# Altium schematic sheet m2_connector.SchDoc
size A4; DocumentNumber: 4; SheetNumber: 4; SheetTotal: 9
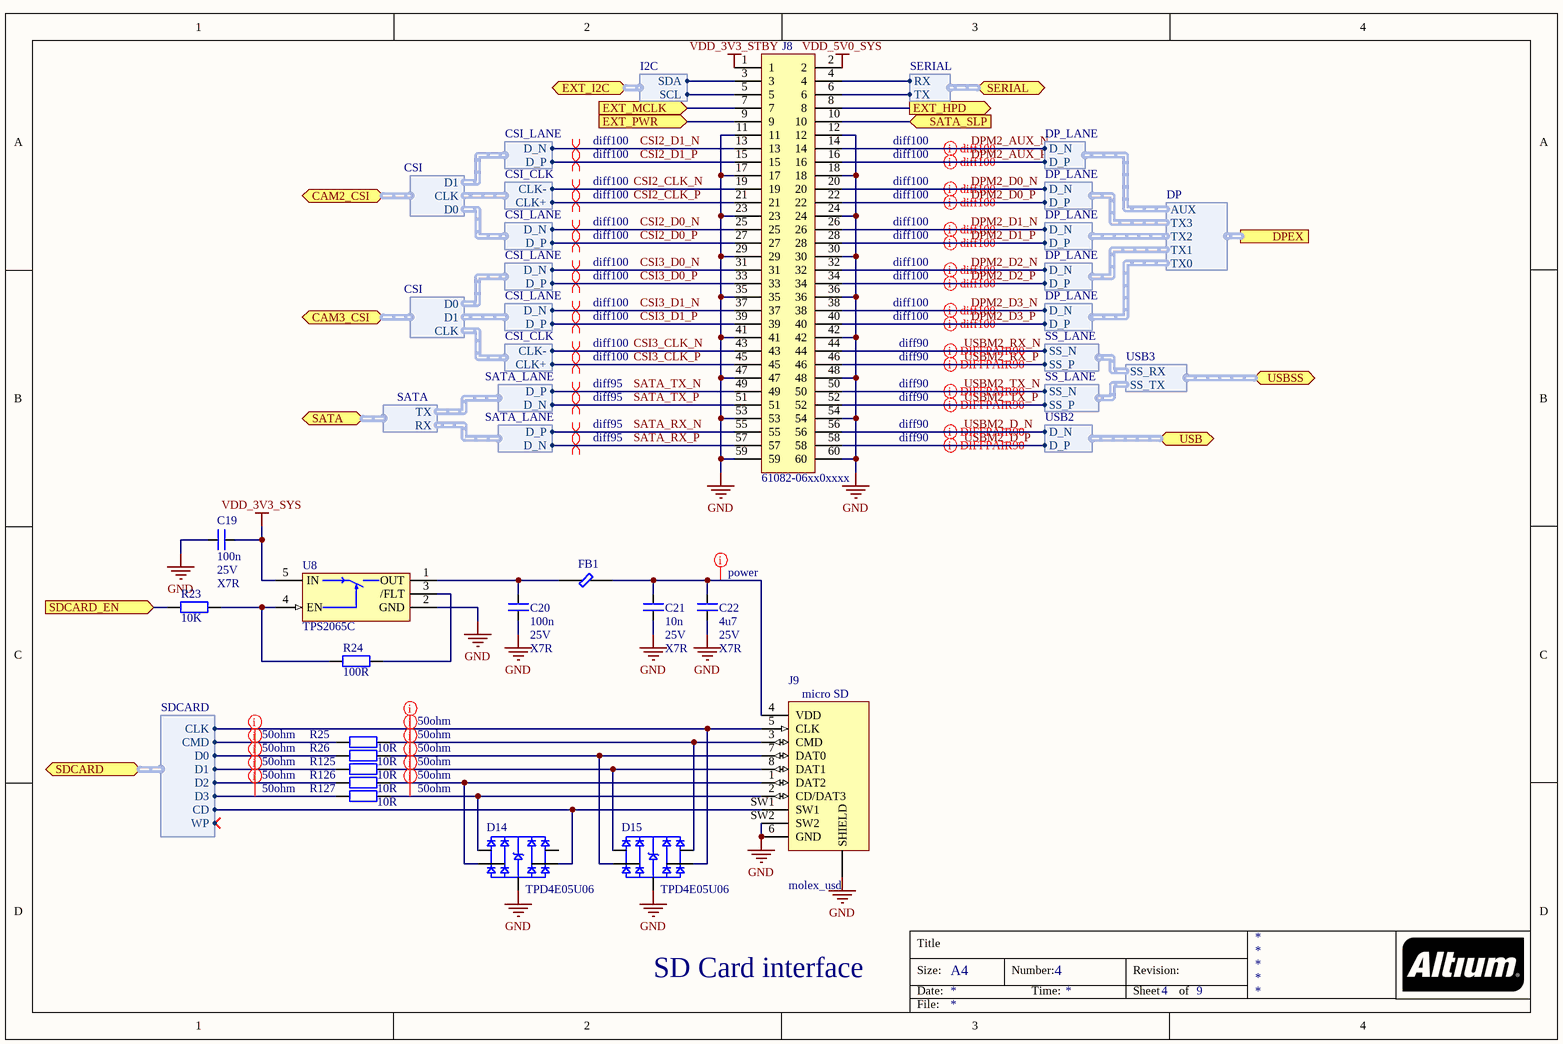
[diagram p0: m2_connector.SchDoc]

## Parts
C19  value 100n  Voltage: 25V  Type: X7R  [C1005[0402]]  (hidden comment: cap)
C20  value 100n  Voltage: 25V  Type: X7R  [C1005[0402]]  (hidden comment: cap)
C21  value 10n  Voltage: 25V  Type: X7R  [C1005[0402]]  (hidden comment: cap)
C22  value 4u7  Voltage: 25V  Type: X7R  [C3216[1206]]  (hidden comment: cap)
D14  TPD4E05U06  [TI_PSON50P100X55-10N]
D15  TPD4E05U06  [TI_PSON50P100X55-10N]
FB1  2506036007Y3  [FBC1608X07N]  (value not drawn)
J8  61082-06xx0xxxx  [fci_mezzanine_61082]
J9  molex_usd  [molex_usd]
R23  value 10K  [R1005[0402]]  (hidden comment: res)
R24  value 100R  [R1005[0402]]  (hidden comment: res)
R25  value 10R  [R1005[0402]]  (hidden comment: res)
R26  value 10R  [R1005[0402]]  (hidden comment: res)
R125  value 10R  [R1005[0402]]  (hidden comment: res)
R126  value 10R  [R1005[0402]]  (hidden comment: res)
R127  value 10R  [R1005[0402]]  (hidden comment: res)
U8  TPS2065C  [TI_SOT95P280X145-5N]

## Ports
CAM2_CSI (harness CSI), CAM3_CSI (harness CSI), DPEX (harness DP), EXT_HPD (out), EXT_I2C (harness I2C), EXT_MCLK (in), EXT_PWR (in), SATA (harness SATA), SATA_SLP (in), SDCARD (harness SDCARD), SDCARD_EN (in), SERIAL (harness SERIAL), USB (harness USB2), USBSS (harness USB3)

## Harnesses
SDCARD: CLK, CMD, WP, CD, D0, D1, D2, D3
SS_LANE: SS_P, SS_N
USB3: SS_RX, SS_TX
DP_LANE: D_N, D_P
DP: TX0, TX1, TX2, TX3, AUX
CSI_LANE: D_P, D_N
CSI_CLK: CLK-, CLK+
CSI: CLK, D0, D1
I2C: SDA, SCL
SATA_LANE: D_P, D_N
SATA: TX, RX
SERIAL: RX, TX
USB2: D_P, D_N

## Nets
GND: C19.2 C20.1 C21.1 C22.1 D14.3(GND) D15.3(GND) J8.11 J8.12 J8.17 J8.18 J8.23 J8.24 J8.29 J8.30 J8.35 J8.36 J8.41 J8.42 J8.47 J8.48 J8.53 J8.54 J8.59 J8.60 J9.6(GND) J9.SHIELD J9.SW2 U8.2(GND)
VDD_3V3_STBY: J8.1
VDD_3V3_SYS: C19.1 U8.5(IN)
VDD_5V0_SYS: J8.2
CSI2_CLK_N: J8.19 ; harness CSI_CLK.CLK-
CSI2_CLK_P: J8.21 ; harness CSI_CLK.CLK+
CSI2_D0_N: J8.25 ; harness CSI_LANE.D_N
CSI2_D0_P: J8.27 ; harness CSI_LANE.D_P
CSI2_D1_N: J8.13 ; harness CSI_LANE.D_N
CSI2_D1_P: J8.15 ; harness CSI_LANE.D_P
CSI3_CLK_N: J8.43 ; harness CSI_CLK.CLK-
CSI3_CLK_P: J8.45 ; harness CSI_CLK.CLK+
CSI3_D0_N: J8.31 ; harness CSI_LANE.D_N
CSI3_D0_P: J8.33 ; harness CSI_LANE.D_P
CSI3_D1_N: J8.37 ; harness CSI_LANE.D_N
CSI3_D1_P: J8.39 ; harness CSI_LANE.D_P
DPM2_AUX_N: J8.14 ; harness DP_LANE.D_N
DPM2_AUX_P: J8.16 ; harness DP_LANE.D_P
DPM2_D0_N: J8.20 ; harness DP_LANE.D_N
DPM2_D0_P: J8.22 ; harness DP_LANE.D_P
DPM2_D1_N: J8.26 ; harness DP_LANE.D_N
DPM2_D1_P: J8.28 ; harness DP_LANE.D_P
DPM2_D2_N: J8.32 ; harness DP_LANE.D_N
DPM2_D2_P: J8.34 ; harness DP_LANE.D_P
DPM2_D3_N: J8.38 ; harness DP_LANE.D_N
DPM2_D3_P: J8.40 ; harness DP_LANE.D_P
EXT_HPD: J8.8 ; port EXT_HPD
EXT_MCLK: J8.7 ; port EXT_MCLK
EXT_PWR: J8.9 ; port EXT_PWR
SATA_RX_N: J8.55 ; harness SATA_LANE.D_P
SATA_RX_P: J8.57 ; harness SATA_LANE.D_N
SATA_SLP: J8.10 ; port SATA_SLP
SATA_TX_N: J8.49 ; harness SATA_LANE.D_P
SATA_TX_P: J8.51 ; harness SATA_LANE.D_N
SDCARD_EN: R23.1 ; port SDCARD_EN
USBM2_D_N: J8.56 ; port USB.D_N
USBM2_D_P: J8.58 ; port USB.D_P
USBM2_RX_N: J8.44 ; harness SS_LANE.SS_N
USBM2_RX_P: J8.46 ; harness SS_LANE.SS_P
USBM2_TX_N: J8.50 ; harness SS_LANE.SS_N
USBM2_TX_P: J8.52 ; harness SS_LANE.SS_P
NetC20_2: C20.2 FB1.1 U8.1(OUT)
NetC21_2: C21.2 C22.2 FB1.2 J9.4(VDD)
NetD14_1: D14.1(D1+) J9.2(CD/DAT3) R127.2
NetD14_2: D14.2(D1-) J9.1(DAT2) R126.2
NetD14_4: D14.4(D2-) J9.SW1 ; port SDCARD.CD
NetD15_1: D15.1(D1+) J9.8(DAT1) R125.2
NetD15_2: D15.2(D1-) J9.7(DAT0) R26.2
NetD15_4: D15.4(D2-) J9.5(CLK) ; port SDCARD.CLK
NetD15_5: D15.5(D2+) J9.3(CMD) R25.2
NetJ8_3: J8.3 ; port EXT_I2C.SDA
NetJ8_4: J8.4 ; port SERIAL.RX
NetJ8_5: J8.5 ; port EXT_I2C.SCL
NetJ8_6: J8.6 ; port SERIAL.TX
NetR23_2: R23.2 R24.1 U8.4(EN)
NetR24_2: R24.2 U8.3(/FLT)
NetR25_1: R25.1 ; port SDCARD.CMD
NetR26_1: R26.1 ; port SDCARD.D0
NetR125_1: R125.1 ; port SDCARD.D1
NetR126_1: R126.1 ; port SDCARD.D2
NetR127_1: R127.1 ; port SDCARD.D3

Not connected (* = marked no-connect by the designer): D14 5(D2+)

## Layout directives
net class power: NetC21_2
differential pair; net class diff90: USBM2_D_N, USBM2_D_P, USBM2_RX_N, USBM2_RX_P, USBM2_TX_N, USBM2_TX_P
differential pair; net class diff100: CSI2_CLK_N, CSI2_CLK_P, CSI2_D0_N, CSI2_D0_P, CSI2_D1_N, CSI2_D1_P, CSI3_CLK_N, CSI3_CLK_P, CSI3_D0_N, CSI3_D0_P, CSI3_D1_N, CSI3_D1_P, DPM2_AUX_N, DPM2_AUX_P, DPM2_D0_N, DPM2_D0_P, DPM2_D1_N, DPM2_D1_P, DPM2_D2_N, DPM2_D2_P, DPM2_D3_N, DPM2_D3_P
differential pair; net class diff95: SATA_RX_N, SATA_RX_P, SATA_TX_N, SATA_TX_P
net class 50ohm: NetD14_1, NetD14_2, NetD15_1, NetD15_2, NetD15_4, NetD15_5, NetR25_1, NetR26_1, NetR125_1, NetR126_1, NetR127_1

## Notes on the sheet
- SD Card interface
- Title
- Size:
- Date:
- A4
- Number:
- Time:
- Revision:
- Sheet
- of
- File:
- (in symbol molex_usd) micro SD

## Library data of the parts
C19-C22 = cap: Capacitor; Manufacturer: *; Series: *
FB1 = ferrite_bead: Ferrite bead
J8 = mezzanine_2x30
R23-R26 R125-R127 = res: Resistor